# EAGLE schematic aq_mx_v1-5-0a (EAGLE 9.6.2)
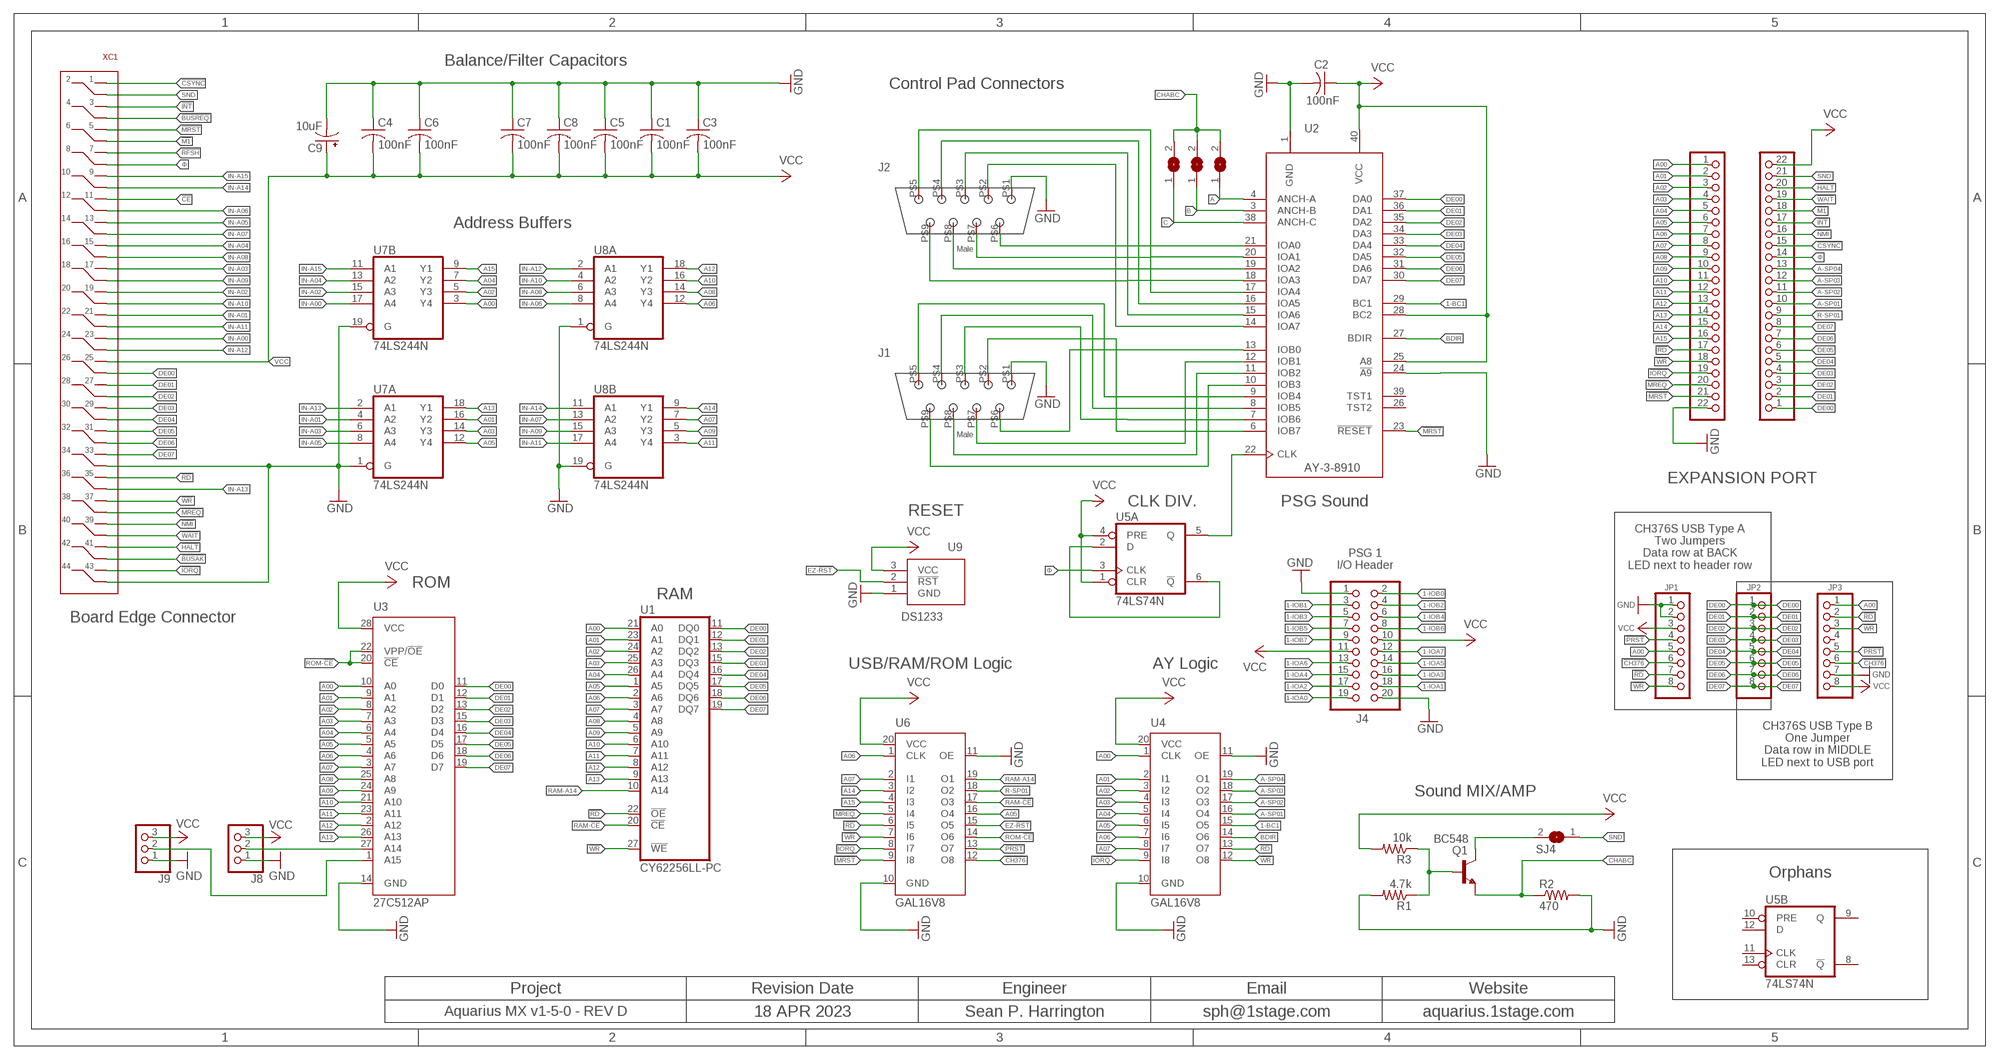
[diagram p0: schematic, sheet 1]

## Parts
C1  100nF  C-US050-025X075  [C050-025X075]
C2  100nF  C-US050-025X075  [C050-025X075]
C3  100nF  C-US050-025X075  [C050-025X075]
C4  100nF  C-US050-025X075  [C050-025X075]
C5  100nF  C-US050-025X075  [C050-025X075]
C6  100nF  C-US050-025X075  [C050-025X075]
C7  100nF  C-US050-025X075  [C050-025X075]
C8  100nF  C-US050-025X075  [C050-025X075]
C9  10uF  CPOL-USE22-6AXIAL  [E22-6]
J1  DB9-MALE-RA  [DB9-MALE-RA]
J2  DB9-MALE-RA  [DB9-MALE-RA]
J4  PINHD-2X10  [2X10]
J6  PINHD-1X22  [1X22]
J7  PINHD-1X22  [1X22]
J8  PINHD-1X3  [1X03]
J9  PINHD-1X3  [1X03]
JP1  PINHD-1X8  [1X08]
JP2  PINHD-1X8  [1X08]
JP3  PINHD-1X8  [1X08]
Q1  BC548  BC548-NPN-TO92-CBE  [TO92-CBE]
R1  4.7k  R-US_0204/7  [0204/7]
R2  470  R-US_0204/7  [0204/7]
R3  10k  R-US_0204/7  [0204/7]
SJ1  SJ  [SJ]
SJ2  SJ  [SJ]
SJ3  SJ  [SJ]
SJ4  SJ  [SJ]
U1  CY62256LL-PC  [DIL28-6]
U2  AY-3-8910  RAD38910DIL40-6  [RAD38910-DIL40-6]
U3  27C512AP  [DIL28-6]
U4  GAL16V8  ATF16V8BP3  [DIL20]
U5  74LS74N  [DIL14]
U6  GAL16V8  ATF16V8BP3  [DIL20]
U7  74LS244N  [DIL20]
U8  74LS244N  [DIL20]
U9  DS1233  DS1233-10+  [TO-92]
XC1  AQ-CART-EDGE  [AQ-CART-EDGE]

## Nets
1-BC1: U2.29(BC1) U4.15(O5)
1-IOA0: J2.P$6 J4.19 U2.21(IOA0)
1-IOA1: J2.P$7 J4.18 U2.20(IOA1)
1-IOA2: J2.P$8 J4.17 U2.19(IOA2)
1-IOA3: J2.P$9 J4.16 U2.18(IOA3)
1-IOA4: J2.P$5 J4.15 U2.17(IOA4)
1-IOA5: J2.P$4 J4.14 U2.16(IOA5)
1-IOA6: J2.P$3 J4.13 U2.15(IOA6)
1-IOA7: J2.P$2 J4.12 U2.14(IOA7)
1-IOB0: J1.P$6 J4.2 U2.13(IOB0)
1-IOB1: J1.P$7 J4.3 U2.12(IOB1)
1-IOB2: J1.P$8 J4.4 U2.11(IOB2)
1-IOB3: J1.P$9 J4.5 U2.10(IOB3)
1-IOB4: J1.P$5 J4.6 U2.9(IOB4)
1-IOB5: J1.P$4 J4.7 U2.8(IOB5)
1-IOB6: J1.P$3 J4.8 U2.7(IOB6)
1-IOB7: J1.P$2 J4.9 U2.6(IOB7)
!BUSAK: XC1.P$42(X42)
!BUSREQ: XC1.P$4(X4)
!CE: XC1.P$11(X11)
!CH376: JP1.6 JP3.6 U6.12(O8)
!CSYNC: J6.15 XC1.P$1(X1)
!HALT: J6.20 XC1.P$41(X41)
!INT: J6.17 XC1.P$3(X3)
!IORQ: J7.19 U4.9(I8) U6.8(I7) XC1.P$43(X43)
!M1: J6.18 XC1.P$6(X6)
!MREQ: J7.20 U6.5(I4) XC1.P$38(X38)
!MRST: J7.21 U2.23(!RESET) U6.9(I8) XC1.P$5(X5)
!NMI: J6.16 XC1.P$39(X39)
!PRST: JP1.4 JP3.5 U6.13(O7)
!RD: J7.17 JP1.7 JP3.2 U1.22(!OE) U4.13(O7) U6.6(I5) XC1.P$35(X35)
!RFSH: XC1.P$7(X7)
!WAIT: J6.19 XC1.P$40(X40)
!WR: J7.18 JP1.8 JP3.3 U1.27(!WE) U4.12(O8) U6.7(I6) XC1.P$37(X37)
A: SJ1.1 U2.4(ANCH-A)
A00: J7.1 JP1.5 JP3.1 U1.21(A0) U3.10(A0) U4.1(CLK) U7.3(B:Y4)
A01: J7.2 U1.23(A1) U3.9(A1) U4.2(I1) U7.16(A:Y2)
A02: J7.3 U1.24(A2) U3.8(A2) U4.3(I2) U7.5(B:Y3)
A03: J7.4 U1.25(A3) U3.7(A3) U4.4(I3) U7.14(A:Y3)
A04: J7.5 U1.26(A4) U3.6(A4) U4.5(I4) U7.7(B:Y2)
A05: J7.6 U1.1(A5) U3.5(A5) U4.6(I5) U6.16(O4) U7.12(A:Y4)
A06: J7.7 U1.2(A6) U3.4(A6) U4.7(I6) U6.1(CLK) U8.12(A:Y4)
A07: J7.8 U1.3(A7) U3.3(A7) U4.8(I7) U6.2(I1) U8.7(B:Y2)
A08: J7.9 U1.4(A8) U3.25(A8) U8.14(A:Y3)
A09: J7.10 U1.5(A9) U3.24(A9) U8.5(B:Y3)
A10: J7.11 U1.6(A10) U3.21(A10) U8.16(A:Y2)
A11: J7.12 U1.7(A11) U3.23(A11) U8.3(B:Y4)
A12: J7.13 U1.8(A12) U3.2(A12) U8.18(A:Y1)
A13: J7.14 U1.9(A13) U3.26(A13) U7.18(A:Y1)
A14: J7.15 U6.3(I2) U8.9(B:Y1)
A15: J7.16 U6.4(I3) U7.9(B:Y1)
A-SP01: J6.10 U4.16(O4)
A-SP02: J6.11 U4.17(O3)
A-SP03: J6.12 U4.18(O2)
A-SP04: J6.13 U4.19(O1)
B: SJ2.1 U2.3(ANCH-B)
BDIR: U2.27(BDIR) U4.14(O6)
C: SJ3.1 U2.38(ANCH-C)
CHABC: Q1.E R2.1 SJ1.2 SJ2.2 SJ3.2
DE00: J6.1 JP2.1 U1.11(DQ0) U2.37(DA0) U3.11(D0) XC1.P$26(X26)
DE01: J6.2 JP2.2 U1.12(DQ1) U2.36(DA1) U3.12(D1) XC1.P$27(X27)
DE02: J6.3 JP2.3 U1.13(DQ2) U2.35(DA2) U3.13(D2) XC1.P$28(X28)
DE03: J6.4 JP2.4 U1.15(DQ3) U2.34(DA3) U3.15(D3) XC1.P$29(X29)
DE04: J6.5 JP2.5 U1.16(DQ4) U2.33(DA4) U3.16(D4) XC1.P$30(X30)
DE05: J6.6 JP2.6 U1.17(DQ5) U2.32(DA5) U3.17(D5) XC1.P$31(X31)
DE06: J6.7 JP2.7 U1.18(DQ6) U2.31(DA6) U3.18(D6) XC1.P$32(X32)
DE07: J6.8 JP2.8 U1.19(DQ7) U2.30(DA7) U3.19(D7) XC1.P$33(X33)
EZ-!RST: U6.15(O5) U9.2(!RST)
GND [Power]: C1.1 C2.2 C3.1 C4.1 C5.1 C6.1 C7.1 C8.1 C9.- J1.P$1 J2.P$1 J4.1 J4.20 J7.22 J8.1 J9.1 JP1.1 JP1.2 JP3.7 R1.2 R2.2 U2.1(GND) U2.24(!A9) U3.14(GND) U4.10(GND) U4.11(OE) U6.10(GND) U6.11(OE) U7.1(A:G) U7.19(B:G) U8.1(A:G) U8.19(B:G) U9.1(GND) XC1.P$34(X34) XC1.P$44(X44)
IN-A00: U7.17(B:A4) XC1.P$23(X23)
IN-A01: U7.4(A:A2) XC1.P$21(X21)
IN-A02: U7.15(B:A3) XC1.P$19(X19)
IN-A03: U7.6(A:A3) XC1.P$17(X17)
IN-A04: U7.13(B:A2) XC1.P$15(X15)
IN-A05: U7.8(A:A4) XC1.P$13(X13)
IN-A06: U8.8(A:A4) XC1.P$12(X12)
IN-A07: U8.13(B:A2) XC1.P$14(X14)
IN-A08: U8.6(A:A3) XC1.P$16(X16)
IN-A09: U8.15(B:A3) XC1.P$18(X18)
IN-A10: U8.4(A:A2) XC1.P$20(X20)
IN-A11: U8.17(B:A4) XC1.P$22(X22)
IN-A12: U8.2(A:A1) XC1.P$24(X24)
IN-A13: U7.2(A:A1) XC1.P$36(X36)
IN-A14: U8.11(B:A1) XC1.P$10(X10)
IN-A15: U7.11(B:A1) XC1.P$9(X9)
N$5: Q1.B R1.1 R3.1
N$52: Q1.C SJ4.2
N$63: U5.2(A:D) U5.6(A:!Q)
N$89: U2.22(CLK) U5.5(A:Q)
R-SP01: J6.9 U6.18(O2)
RAM-!CE: U1.20(!CE) U6.17(O3)
RAM-A14: U1.10(A14) U6.19(O1)
ROM-!CE: U3.20(!CE) U3.22(VPP/!OE) U6.14(O6)
ROM-A14: J8.2 U3.27(A14)
ROM-A15: J9.2 U3.1(A15)
SND: J6.21 SJ4.1 XC1.P$2(X2)
VCC [Power]: C1.2 C2.1 C3.2 C4.2 C5.2 C6.2 C7.2 C8.2 C9.+ J4.10 J4.11 J6.22 J8.3 J9.3 JP1.3 JP3.8 R3.2 U2.25(A8) U2.28(BC2) U2.40(VCC) U3.28(VCC) U4.20(VCC) U5.1(A:CLR) U5.4(A:PRE) U6.20(VCC) U9.3(VCC) XC1.P$25(X25)
Φ: J6.14 U5.3(A:CLK) XC1.P$8(X8)
Unconnected: JP3.4 U2.26(TST2) U2.39(TST1) U5.8(B:!Q) U5.9(B:Q) U5.10(B:PRE) U5.11(B:CLK) U5.12(B:D) U5.13(B:CLR)

## Notes on the sheet
- Balance/Filter Capacitors
- Control Pad Connectors
- Address Buffers
- EXPANSION PORT
- CLK DIV. | PSG Sound
- RESET
- PSG 1
  I/O Header
- CH376S USB Type A
  Two Jumpers
  Data row at BACK
  LED next to header row
- ROM
- RAM
- Board Edge Connector
- USB/RAM/ROM Logic | AY Logic
- CH376S USB Type B
  One Jumper
  Data row in MIDDLE
  LED next to USB port
- Sound MIX/AMP
- Orphans
- Project | Revision Date | Engineer | Email | Website
- Aquarius MX v1-5-0 - REV D | 18 APR 2023 | Sean P. Harrington | sph@1stage.com | aquarius.1stage.com

## Power pins joined to a net without a drawn wire
GND: U1.14(GND) U5.7(P:GND) U7.10(P:GND) U8.10(P:GND)
VCC: U1.28(VCC) U5.14(P:VCC) U7.20(P:VCC) U8.20(P:VCC)

## Library data of the parts
C1-C8 = rcl:C-US: CAPACITOR, American symbol; SPICEPREFIX: C
C9 = aq-rcl:CPOL-US: POLARIZED CAPACITOR, American symbol; SPICEPREFIX: C
J1 J2 = aquarius:DB9-MALE-RA
J4 = aquarius2:PINHD-2X10: PIN HEADER
J6 J7 = aquarius2:PINHD-1X22: PIN HEADER
J8 J9 = aquarius2:PINHD-1X3: PIN HEADER
JP1-JP3 = aquarius2:PINHD-1X8: PIN HEADER
Q1 = transistor:*-NPN-: NPN Transistror BF959 corrected 2008.03.06
R1-R3 = aq-rcl:R-US_: RESISTOR, American symbol; SPICEPREFIX: R
SJ1-SJ4 = jumper:SJ: SMD solder JUMPER
U1 = memory-sram:CY62256LL-?*: 256K (32K x 8) CMOS-Static RAM Source: http://download.cypress.com.edgesuite.net/design_resources/datasheets/contents/cy62256_8.pdf
U2 = aquarius:RAD38910
U3 = microchip:27*512A: CMOS EPROM 512 K (64 K x 8); MPN: M27C512-90B6; OC_FARNELL: 1642690; OC_NEWARK: 20M6389
U4 U6 = atmel:ATF16V8B: High perfomance CMOS (electrically erasable) programmable logic device (PLD) ABLE-Atmel-ABEL - P18V8R, P16V8C, P16V8AS, P17V8 COPL Atmel-WinCUPL - G16V8MS, G16V8MA, G16V8AS, G16V8 LOG/IC - GAL16V8_R, GAL16V8_G7, GAL16V8_C), GAL16V8 Tango-PLD - G16V8R, G16V8C, G16V8AS, G16V8 Source: http://www.atmel.com/dyn/resources/prod_documents/DOC0364.PDF; MPN: ATF16V8CZ-15PU; OC_FARNELL: 1551768; OC_NEWARK: 94M6254
U5 = 74xx-us:74*74: Dual D type positive edge triggered FLIP FLOP, preset and clear
U7 U8 = 74xx-us:74*244: Octal BUFFER and LINE DRIVER, 3-state
U9 = SamacSys_Parts:DS1233-10+: DS1233-10+, Processor Supervisor 5V Active Low, Open Drain, Reset 3-Pin TO-92 Source: Datasheet <https://datasheet.datasheetarchive.com/originals/distributors/Datasheets-18/DSA-345030.pdf>; ARROW_PART_NUMBER: DS1233-10+; ARROW_PRICE-STOCK: https://www.arrow.com/en/products/ds1233-10/maxim-integrated?region=nac; DESCRIPTION: DS1233-10+, Processor Supervisor 5V Active Low, Open Drain, Reset 3-Pin TO-92; HEIGHT: mm; MANUFACTURER_NAME: Maxim Integrated; MANUFACTURER_PART_NUMBER: DS1233-10+; MOUSER_PART_NUMBER: 700-DS1233-10; MOUSER_PRICE-STOCK: https://www.mouser.co.uk/ProductDetail/Maxim-Integrated/DS1233-10%2b?qs=0Y9aZN%252BMVCXd7HuNF9dj5A%3D%3D
XC1 = aquarius:AQ-CART-EDGE

## Net classes
1 Power: width 0.305 mm, drill 0.102 mm, clearance 0.076 mm